# EasyEDA Pro project ProPrj_智能视觉集成板-V3.0.epro, schematic Schematic4

## Sheets
1 电源: Board Name: RGB灯板; Create Date: 2025-04-21; Page Name: 电源; Project Name: 009-智能视觉集成板-V2.0; Schematic Name: Schematic4; Update Date: 2025-04-23; Company: 嘉立创EDA; Page Size: A4; Version: V1.0
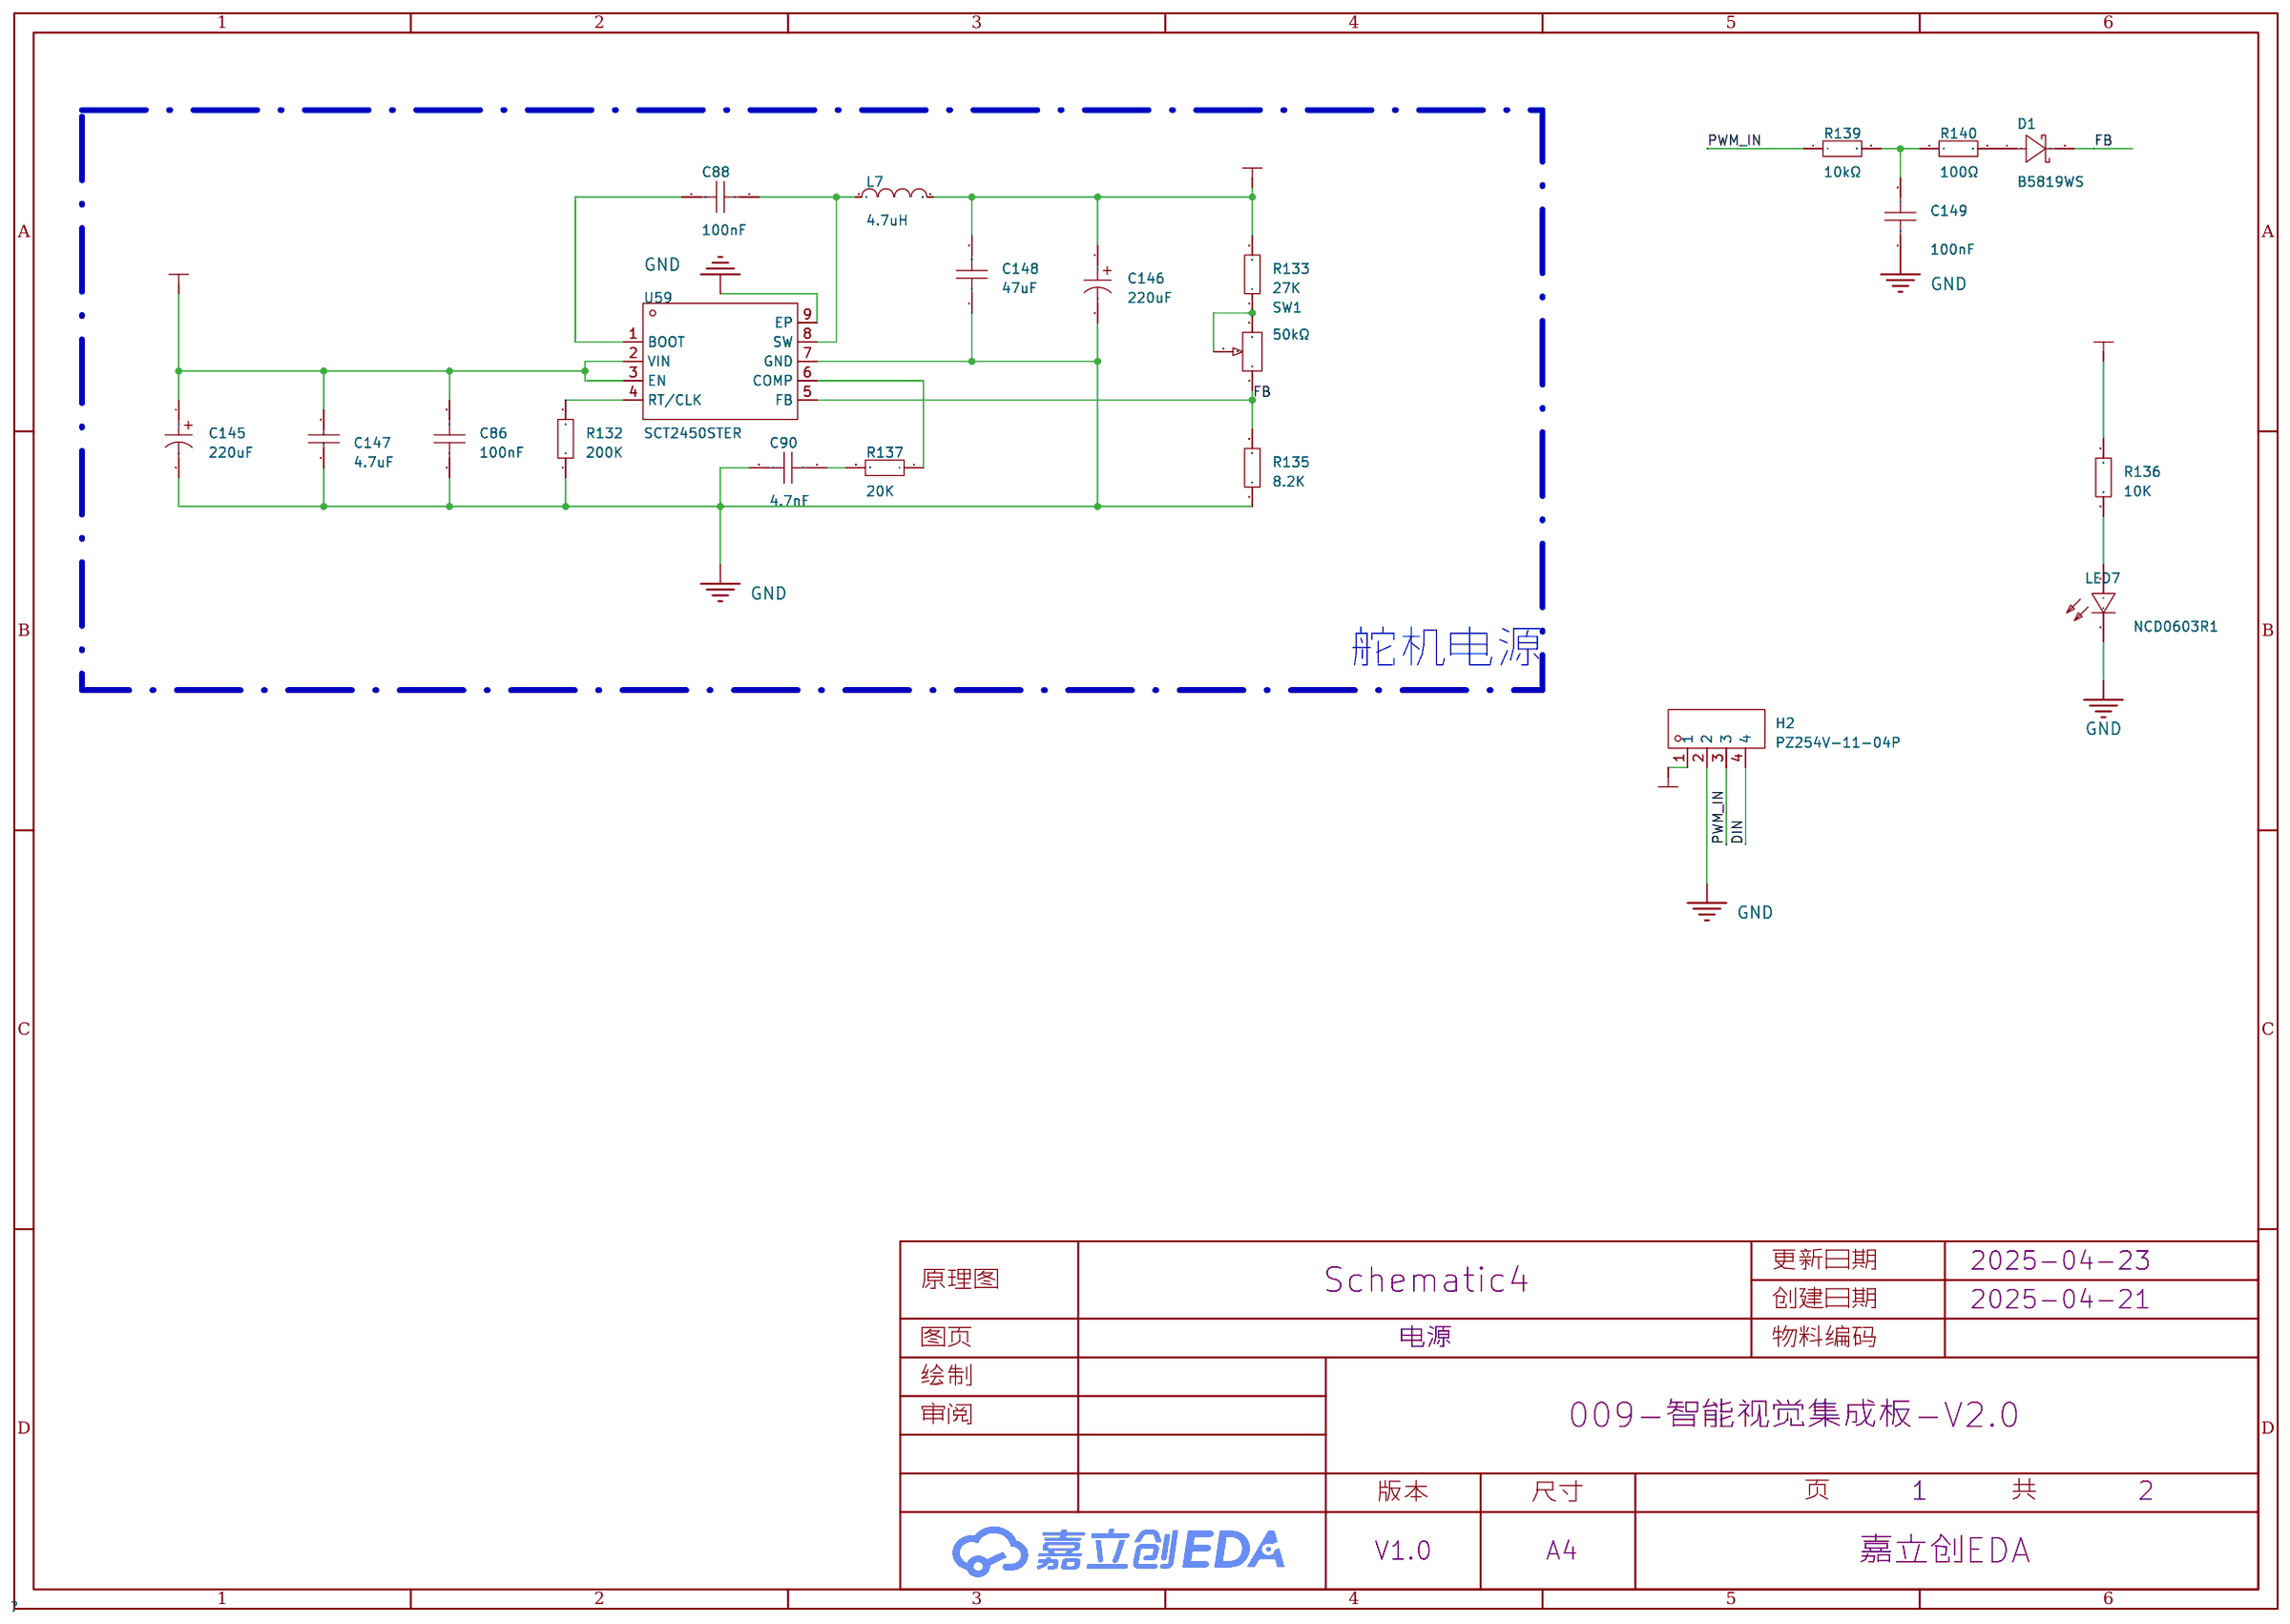
[diagram p11: 电源]
2 灯珠: Create Date: 2025-04-23; Page Name: 灯珠
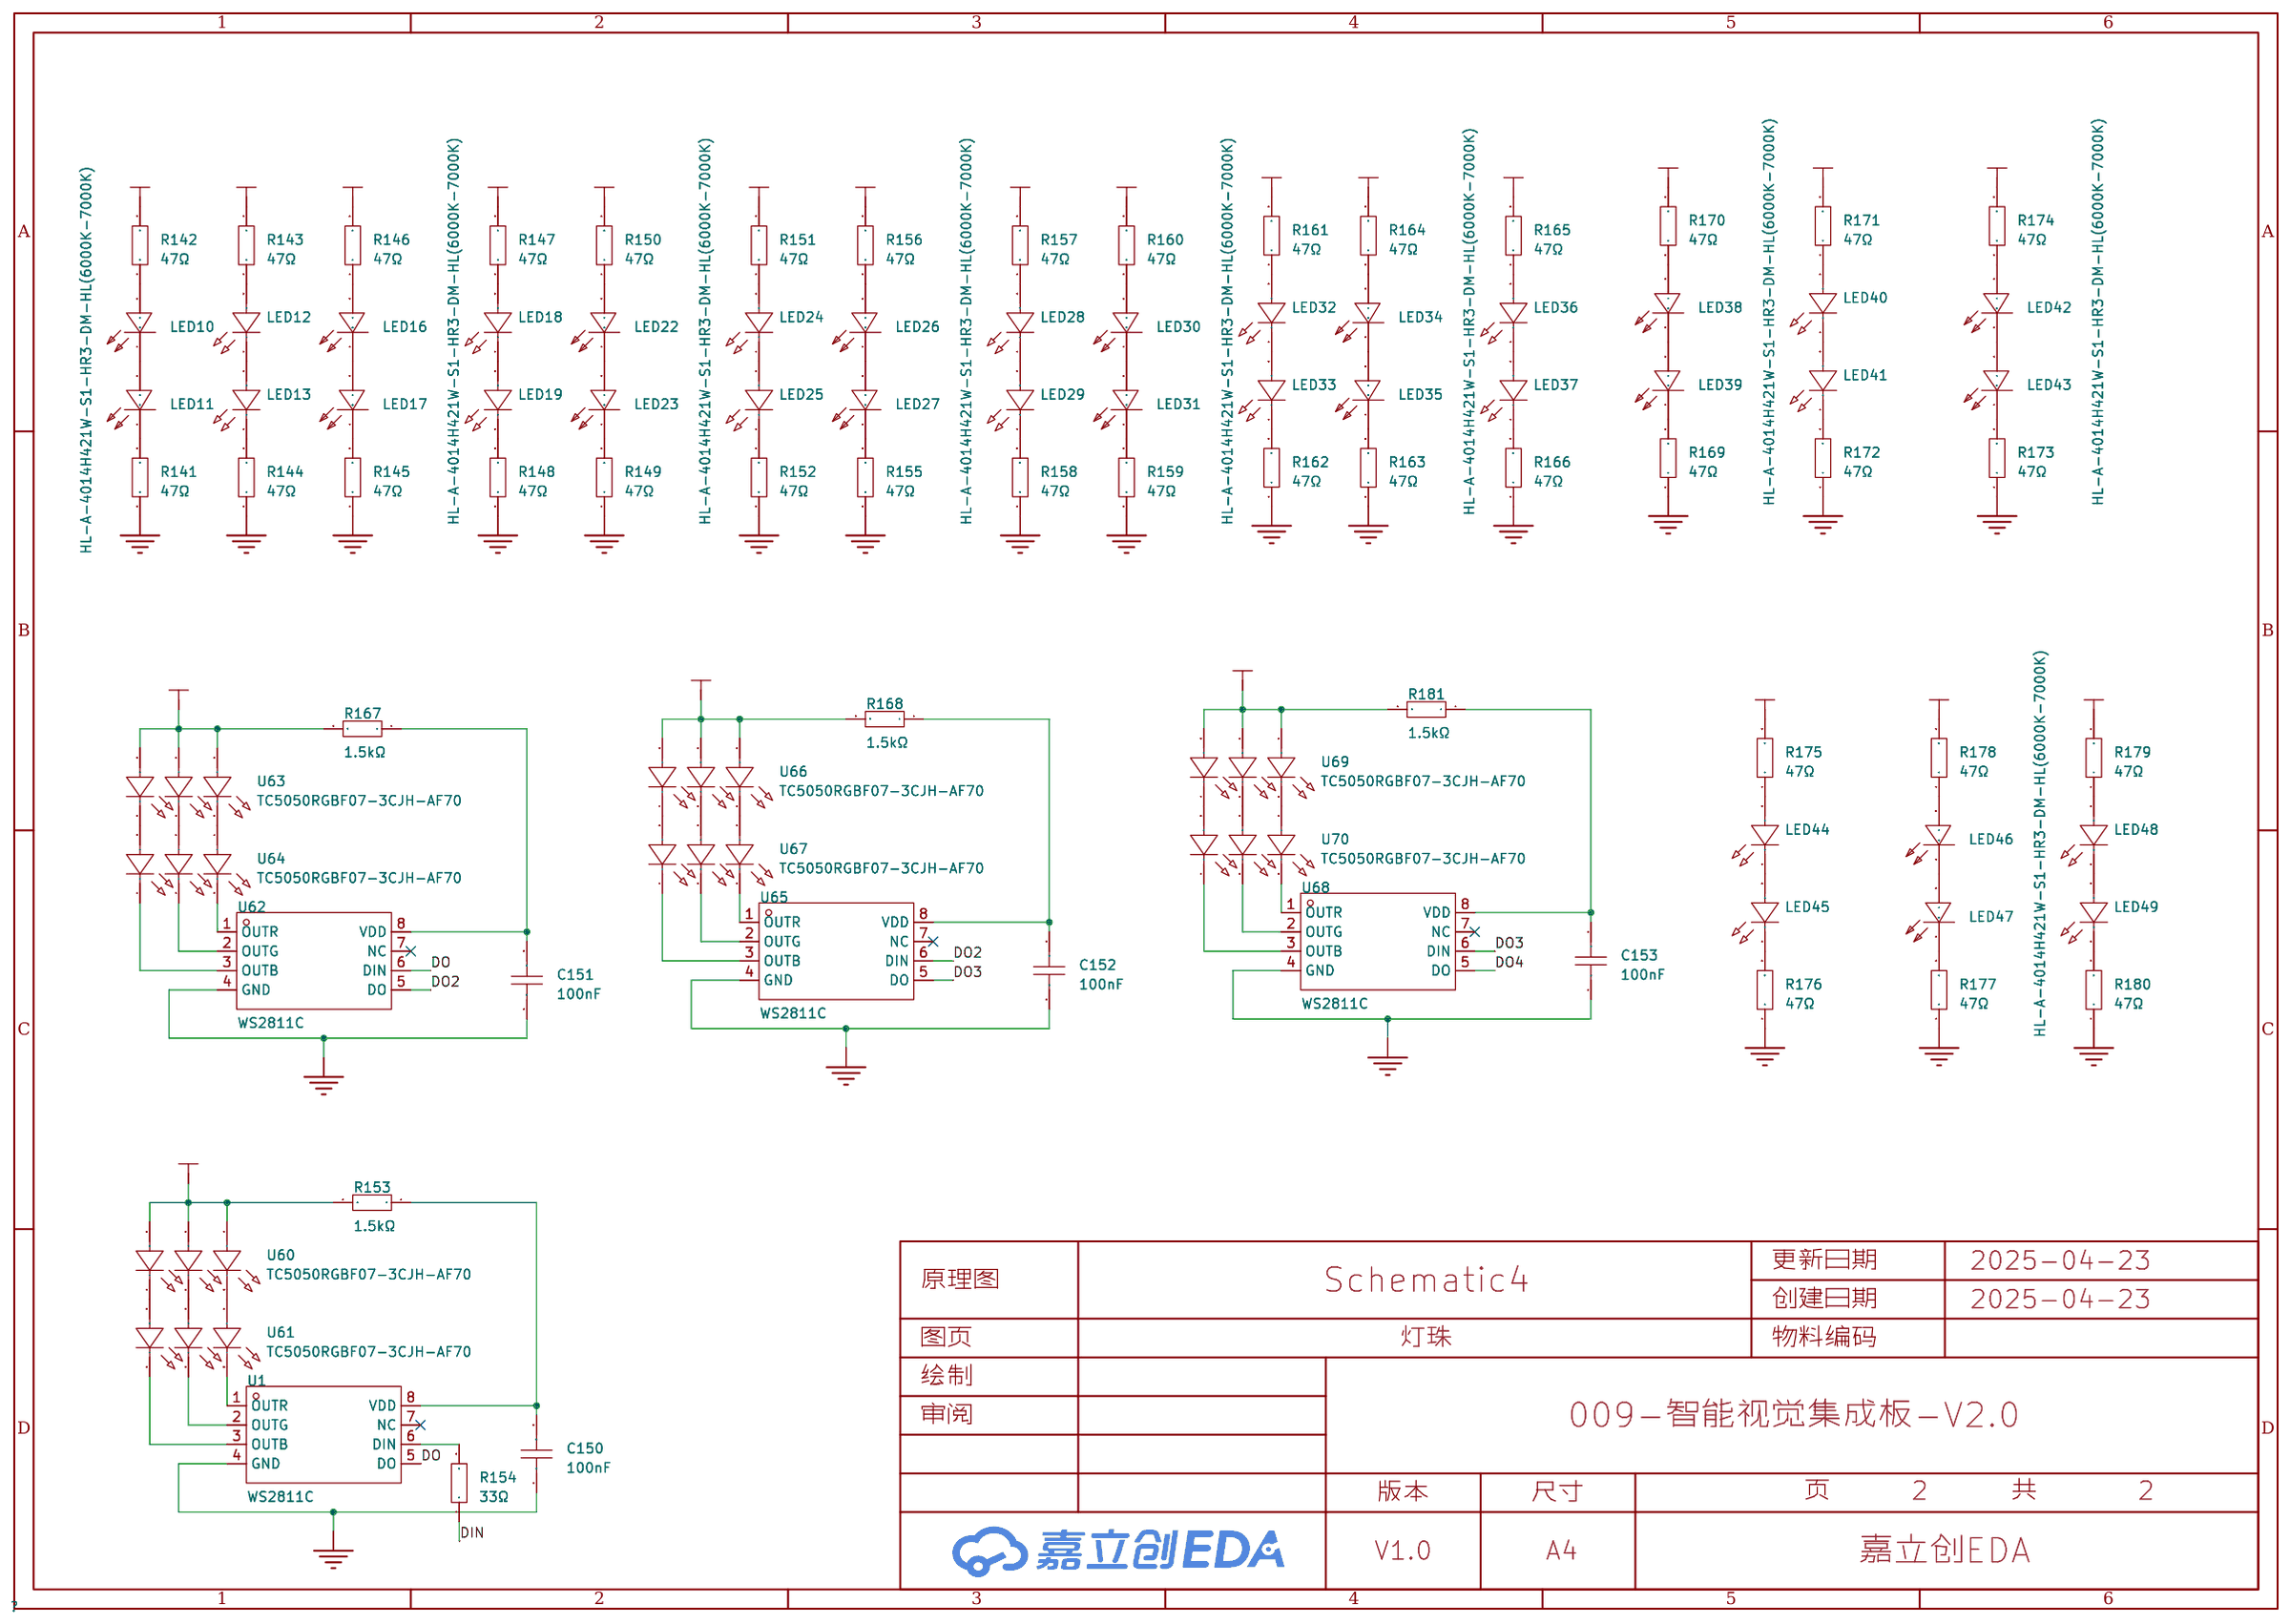
[diagram p12: 灯珠]

## Parts
sheet 灯珠
C150  100nF  [C0603]
C151  100nF  [C0603]
C152  100nF  [C0603]
C153  100nF  [C0603]
LED10  HL-A-4014H421W-S1-HR3-DM-HL(6000K-7000K)  [LED-SMD_L4.0-W1.5-RD]
LED11  HL-A-4014H421W-S1-HR3-DM-HL(6000K-7000K)  [LED-SMD_L4.0-W1.5-RD]
LED12  HL-A-4014H489W-S1-HR3-DM-HL(2800K-3100K)  [LED-SMD_L4.0-W1.5-RD]
LED13  HL-A-4014H489W-S1-HR3-DM-HL(2800K-3100K)  [LED-SMD_L4.0-W1.5-RD]
LED16  HL-A-4014H421W-S1-HR3-DM-HL(6000K-7000K)  [LED-SMD_L4.0-W1.5-RD]
LED17  HL-A-4014H421W-S1-HR3-DM-HL(6000K-7000K)  [LED-SMD_L4.0-W1.5-RD]
LED18  HL-A-4014H489W-S1-HR3-DM-HL(2800K-3100K)  [LED-SMD_L4.0-W1.5-RD]
LED19  HL-A-4014H489W-S1-HR3-DM-HL(2800K-3100K)  [LED-SMD_L4.0-W1.5-RD]
LED22  HL-A-4014H421W-S1-HR3-DM-HL(6000K-7000K)  [LED-SMD_L4.0-W1.5-RD]
LED23  HL-A-4014H421W-S1-HR3-DM-HL(6000K-7000K)  [LED-SMD_L4.0-W1.5-RD]
LED24  HL-A-4014H489W-S1-HR3-DM-HL(2800K-3100K)  [LED-SMD_L4.0-W1.5-RD]
LED25  HL-A-4014H489W-S1-HR3-DM-HL(2800K-3100K)  [LED-SMD_L4.0-W1.5-RD]
LED26  HL-A-4014H421W-S1-HR3-DM-HL(6000K-7000K)  [LED-SMD_L4.0-W1.5-RD]
LED27  HL-A-4014H421W-S1-HR3-DM-HL(6000K-7000K)  [LED-SMD_L4.0-W1.5-RD]
LED28  HL-A-4014H489W-S1-HR3-DM-HL(2800K-3100K)  [LED-SMD_L4.0-W1.5-RD]
LED29  HL-A-4014H489W-S1-HR3-DM-HL(2800K-3100K)  [LED-SMD_L4.0-W1.5-RD]
LED30  HL-A-4014H421W-S1-HR3-DM-HL(6000K-7000K)  [LED-SMD_L4.0-W1.5-RD]
LED31  HL-A-4014H421W-S1-HR3-DM-HL(6000K-7000K)  [LED-SMD_L4.0-W1.5-RD]
LED32  HL-A-4014H489W-S1-HR3-DM-HL(2800K-3100K)  [LED-SMD_L4.0-W1.5-RD]
LED33  HL-A-4014H489W-S1-HR3-DM-HL(2800K-3100K)  [LED-SMD_L4.0-W1.5-RD]
LED34  HL-A-4014H421W-S1-HR3-DM-HL(6000K-7000K)  [LED-SMD_L4.0-W1.5-RD]
LED35  HL-A-4014H421W-S1-HR3-DM-HL(6000K-7000K)  [LED-SMD_L4.0-W1.5-RD]
LED36  HL-A-4014H489W-S1-HR3-DM-HL(2800K-3100K)  [LED-SMD_L4.0-W1.5-RD]
LED37  HL-A-4014H489W-S1-HR3-DM-HL(2800K-3100K)  [LED-SMD_L4.0-W1.5-RD]
LED38  HL-A-4014H421W-S1-HR3-DM-HL(6000K-7000K)  [LED-SMD_L4.0-W1.5-RD]
LED39  HL-A-4014H421W-S1-HR3-DM-HL(6000K-7000K)  [LED-SMD_L4.0-W1.5-RD]
LED40  HL-A-4014H489W-S1-HR3-DM-HL(2800K-3100K)  [LED-SMD_L4.0-W1.5-RD]
LED41  HL-A-4014H489W-S1-HR3-DM-HL(2800K-3100K)  [LED-SMD_L4.0-W1.5-RD]
LED42  HL-A-4014H421W-S1-HR3-DM-HL(6000K-7000K)  [LED-SMD_L4.0-W1.5-RD]
LED43  HL-A-4014H421W-S1-HR3-DM-HL(6000K-7000K)  [LED-SMD_L4.0-W1.5-RD]
LED44  HL-A-4014H489W-S1-HR3-DM-HL(2800K-3100K)  [LED-SMD_L4.0-W1.5-RD]
LED45  HL-A-4014H489W-S1-HR3-DM-HL(2800K-3100K)  [LED-SMD_L4.0-W1.5-RD]
LED46  HL-A-4014H421W-S1-HR3-DM-HL(6000K-7000K)  [LED-SMD_L4.0-W1.5-RD]
LED47  HL-A-4014H421W-S1-HR3-DM-HL(6000K-7000K)  [LED-SMD_L4.0-W1.5-RD]
LED48  HL-A-4014H489W-S1-HR3-DM-HL(2800K-3100K)  [LED-SMD_L4.0-W1.5-RD]
LED49  HL-A-4014H489W-S1-HR3-DM-HL(2800K-3100K)  [LED-SMD_L4.0-W1.5-RD]
R141  47Ω  [R0805]
R142  47Ω  [R0805]
R143  47Ω  [R0805]
R144  47Ω  [R0805]
R145  47Ω  [R0805]
R146  47Ω  [R0805]
R147  47Ω  [R0805]
R148  47Ω  [R0805]
R149  47Ω  [R0805]
R150  47Ω  [R0805]
R151  47Ω  [R0805]
R152  47Ω  [R0805]
R153  1.5kΩ  [R0603]
R154  33Ω  [R0603]
R155  47Ω  [R0805]
R156  47Ω  [R0805]
R157  47Ω  [R0805]
R158  47Ω  [R0805]
R159  47Ω  [R0805]
R160  47Ω  [R0805]
R161  47Ω  [R0805]
R162  47Ω  [R0805]
R163  47Ω  [R0805]
R164  47Ω  [R0805]
R165  47Ω  [R0805]
R166  47Ω  [R0805]
R167  1.5kΩ  [R0603]
R168  1.5kΩ  [R0603]
R169  47Ω  [R0805]
R170  47Ω  [R0805]
R171  47Ω  [R0805]
R172  47Ω  [R0805]
R173  47Ω  [R0805]
R174  47Ω  [R0805]
R175  47Ω  [R0805]
R176  47Ω  [R0805]
R177  47Ω  [R0805]
R178  47Ω  [R0805]
R179  47Ω  [R0805]
R180  47Ω  [R0805]
R181  1.5kΩ  [R0603]
U1  WS2811C  [SOP-8_L4.9-W3.9-P1.27-LS6.0-BL]
U60  TC5050RGBF07-3CJH-AF70  [LED-SMD_6P-L5.0-W5.0-TL_TC5050RGBF08]
U61  TC5050RGBF07-3CJH-AF70  [LED-SMD_6P-L5.0-W5.0-TL_TC5050RGBF08]
U62  WS2811C  [SOP-8_L4.9-W3.9-P1.27-LS6.0-BL]
U63  TC5050RGBF07-3CJH-AF70  [LED-SMD_6P-L5.0-W5.0-TL_TC5050RGBF08]
U64  TC5050RGBF07-3CJH-AF70  [LED-SMD_6P-L5.0-W5.0-TL_TC5050RGBF08]
U65  WS2811C  [SOP-8_L4.9-W3.9-P1.27-LS6.0-BL]
U66  TC5050RGBF07-3CJH-AF70  [LED-SMD_6P-L5.0-W5.0-TL_TC5050RGBF08]
U67  TC5050RGBF07-3CJH-AF70  [LED-SMD_6P-L5.0-W5.0-TL_TC5050RGBF08]
U68  WS2811C  [SOP-8_L4.9-W3.9-P1.27-LS6.0-BL]
U69  TC5050RGBF07-3CJH-AF70  [LED-SMD_6P-L5.0-W5.0-TL_TC5050RGBF08]
U70  TC5050RGBF07-3CJH-AF70  [LED-SMD_6P-L5.0-W5.0-TL_TC5050RGBF08]
sheet 电源
C86  100nF  [C0603]
C88  100nF  [C0603]
C90  4.7nF  [C0603]
C145  220uF  [CAP-SMD_BD6.3-L6.6-W6.6-LS7.8-FD]
C146  220uF  [CAP-SMD_BD6.3-L6.6-W6.6-LS7.8-FD]
C147  4.7uF  [c1206]
C148  47uF  [c1206]
C149  100nF  [C0603]
D1  B5819WS  [SOD-323_L1.7-W1.3-LS2.5-FD]
H2  PZ254V-11-04P  [HDR-TH_4P-P2.54-V-M]
L7  4.7uH  [IND-SMD_L7.0-W6.6]
LED7  NCD0603R1  [LED0603-RD_RED]
R132  200K  [R0603]
R133  27K  [R0603]
R135  8.2K  [R0603]
R136  10K  [R0603]
R137  20K  [R0603]
R139  10kΩ  [R0603]
R140  100Ω  [R0603]
SW1  50kΩ  [RES-ADJ-TH_3P-L5.0-W4.5-P2.35-BR]
U59  SCT2450STER  [ESOP-8_L4.9-W3.9-P1.27-LS6.0-BL-EP]

## Library data of the parts
C150-C153 = CGA0603X7R104K500JT: 容值:100nF;精度:±10%;额定电压:50V;材质(温度系数):X7R;; LCSC Part Name: 100nF ±10% 50V; Supplier Part: C6119867; Manufacturer: HRE(芯声); Supplier Footprint: 0603; JLCPCB Part Class: 扩展库; Supplier: LCSC; Tolerance: ±10%; Voltage Rated: 50V; Temperature Coefficient: X7R
LED10 LED11 LED16 LED17 LED22 LED23 LED26 LED27 LED30 LED31 LED34 LED35 LED38 LED39 LED42 LED43 LED46 LED47 = HL-A-4014H421W-S1-HR3-DM-HL(6000K-7000K): 发光颜色:白色;正向电压(VF):3.2V;功率:288mW;正向电流:60mA;主波长:-;透镜颜色:雾状黄透镜;色温:6500K;发光角度:120°;载带方式:正贴;工作温度:-40℃~+85℃;; LCSC Part Name: 白灯 正贴 色温6500K; Supplier Part: C540979; Manufacturer: HONGLITRONIC(鸿利光电); Supplier Footprint: SMD4014; JLCPCB Part Class: 扩展库; Datasheet: https://atta.szlcsc.com/upload/public/pdf/source/20200518/C540979_90E6DF61BE042BE563F72A358322B1E3.pdf; Supplier: LCSC; Emitted Color: 白色; Forward Voltage (VF): 3.2V; Power Dissipation: 288mW; Forward Current: 60mA; Lens Color: 雾状黄透镜; Color Temperature: 6500K; Viewing Angle: 120°; Mounting Sytle: 正贴; Operating Temperature: -40℃~+85℃
LED12 LED13 LED18 LED19 LED24 LED25 LED28 LED29 LED32 LED33 LED36 LED37 LED40 LED41 LED44 LED45 LED48 LED49 = HL-A-4014H489W-S1-HR3-DM-HL(2800K-3100K): 发光颜色:白色;正向电压(VF):3.4V;功率:306mW;正向电流:60mA;主波长:-;透镜颜色:雾状黄透镜;色温:3000K;发光角度:120°;载带方式:正贴;工作温度:-40℃~+85℃;; LCSC Part Name: 白灯 正贴 色温3000K; Supplier Part: C540980; Manufacturer: HONGLITRONIC(鸿利光电); Supplier Footprint: SMD4014; JLCPCB Part Class: 扩展库; Datasheet: https://atta.szlcsc.com/upload/public/pdf/source/20200518/C540980_B9AC19FAE577749784BDD41A9FD7C64C.pdf; Supplier: LCSC; Emitted Color: 白色; Forward Voltage (VF): 3.4V; Power Dissipation: 306mW; Forward Current: 60mA; Lens Color: 雾状黄透镜; Color Temperature: 3000K; Viewing Angle: 120°; Mounting Sytle: 正贴; Operating Temperature: -40℃~+85℃
R141-R152 R155-R166 R169-R180 = 0805W8F470JT5E: 电阻类型:厚膜电阻;阻值:47Ω;精度:±1%;功率:125mW;最大工作电压:150V;温度系数:±200ppm/℃;; LCSC Part Name: 47Ω ±1% 125mW 厚膜电阻; Supplier Part: C17714; Manufacturer: UNI-ROYAL(厚声); Supplier Footprint: 0805; JLCPCB Part Class: 基础库; Datasheet: https://atta.szlcsc.com/upload/public/pdf/source/20200306/C422600_1E6D84923E4A46A82E41ADD87F860B5C.pdf; Supplier: LCSC; Type: 厚膜电阻; Tolerance: ±1%; Power(Watts): 125mW; Overload Voltage (Max): 150V; Temperature Coefficient: ±200ppm/℃; Operating Temperature Range: -55℃~+155℃
R153 R167 R168 R181 = 0603WAF1501T5E: 电阻类型:厚膜电阻;阻值:1.5kΩ;精度:±1%;功率:100mW;最大工作电压:75V;温度系数:±100ppm/℃;; LCSC Part Name: 1.5kΩ ±1% 100mW 厚膜电阻; Supplier Part: C22843; Manufacturer: UNI-ROYAL(厚声); Supplier Footprint: 0603; JLCPCB Part Class: 基础库; Datasheet: https://atta.szlcsc.com/upload/public/pdf/source/20200306/C422600_1E6D84923E4A46A82E41ADD87F860B5C.pdf; Supplier: LCSC; Type: 厚膜电阻; Tolerance: ±1%; Power(Watts): 100mW; Overload Voltage (Max): 75V; Temperature Coefficient: ±100ppm/℃; Operating Temperature Range: -55℃~+155℃
R154 = 0603WAF330JT5E: 电阻类型:厚膜电阻;阻值:33Ω;精度:±1%;功率:100mW;最大工作电压:75V;温度系数:±100ppm/℃;; LCSC Part Name: 33Ω ±1% 100mW 厚膜电阻; Supplier Part: C23140; Manufacturer: UNI-ROYAL(厚声); Supplier Footprint: 0603; JLCPCB Part Class: 基础库; Datasheet: https://atta.szlcsc.com/upload/public/pdf/source/20200306/C422600_1E6D84923E4A46A82E41ADD87F860B5C.pdf; Supplier: LCSC; Type: 厚膜电阻; Tolerance: ±1%; Power(Watts): 100mW; Overload Voltage (Max): 75V; Temperature Coefficient: ±100ppm/℃; Operating Temperature Range: -55℃~+155℃
U1 U62 U65 U68 = WS2811C: 输入电压:5V~24V;通道数:3;输出电压:20V;输出电流:32mA;; Supplier Part: C2920043; Manufacturer: worldsemi; Supplier Footprint: SOP-8; JLCPCB Part Class: 扩展库; Datasheet: https://atta.szlcsc.com/upload/public/pdf/source/20211117/9A65CCC6E94FC3084B6BF134B7D41FBE.pdf; Supplier: LCSC; Input Voltage: 5V~24V; Channels: 3; Output Voltage: 20V; Output Current: 32mA
U60 U61 U63 U64 U66 U67 U69 U70 = TC5050RGBF07-3CJH-AF70: 5050 LED灯珠  全彩灯珠 5050三基色 七彩灯珠; LCSC Part Name: LED贴片5050RGB灯珠高亮红绿蓝三色 0.2W; Supplier Part: C7495074; Manufacturer: TCWIN(天成); Supplier Footprint: SMD5050-6P; JLCPCB Part Class: 扩展库; Datasheet: https://atta.szlcsc.com/upload/public/pdf/source/20230928/4E7B1469C4A2562BECC3224328AE73AE.pdf; Supplier: LCSC
C86 C88 C90 C149 = CAP_0603: Supplier Footprint: 0603
C145 C146 = GVT1E227M0608CNVC: 容值:220uF;精度:±20%;额定电压:25V;纹波电流:120mA@120Hz;; LCSC Part Name: 220uF ±20% 25V; Supplier Part: C2983317; Manufacturer: HRK(鸿瑞凯电子); Supplier Footprint: SMD,D6.3xL7.7mm; JLCPCB Part Class: 扩展库; Datasheet: https://atta.szlcsc.com/upload/public/pdf/source/20220321/A04A91A46495B899B204BF58325E1842.pdf; Supplier: LCSC; Tolerance: ±20%; Rated Voltage: 25V; Ripple Current: 120mA@120Hz; φD: 6.3mm; L: 8mm; Lifetime @ Temp: 2000hrs@105℃; Operating Temperature: -55℃~+105℃
C147 = CL31B475KBHNNNE: 容值:4.7uF;精度:±10%;额定电压:50V;材质(温度系数):X7R;; LCSC Part Name: 4.7uF ±10% 50V; Supplier Part: C51205; Manufacturer: SAMSUNG(三星); Supplier Footprint: 1206; JLCPCB Part Class: 扩展库; Datasheet: https://atta.szlcsc.com/upload/public/pdf/source/20160218/1457707763339.pdf; Supplier: LCSC; Tolerance: ±10%; Voltage Rated: 50V; Temperature Coefficient: X7R
C148 = HGC1206R5476M250NSPJ: 容值:47uF;精度:±20%;额定电压:25V;材质(温度系数):X5R;; LCSC Part Name: 47uF ±20% 25V; Supplier Part: C22367835; Manufacturer: Chinocera(华瓷); Supplier Footprint: 1206; JLCPCB Part Class: 扩展库; Datasheet: https://atta.szlcsc.com/upload/public/pdf/source/20240326/E6CB0DC43BB858B74F4352229FABFDCA.pdf; Supplier: LCSC; Tolerance: ±20%; Voltage Rated: 25V; Temperature Coefficient: X5R
D1 = B5819WS_C7420331: 二极管配置:独立式;正向压降(Vf):600mV@1.0A;直流反向耐压(Vr):40V;整流电流:1A;; LCSC Part Name: 电压:40V 电流:1A; Supplier Part: C7420331; Manufacturer: 宏迦橙; Supplier Footprint: SOD-323; JLCPCB Part Class: 扩展库; Datasheet: https://atta.szlcsc.com/upload/public/pdf/source/20230828/03CA0F4F90DAE368A7153B7B5E4D0651.pdf; Supplier: LCSC; Diode Configuration: 独立式; Forward Voltage (Vf@If): 600mV@1.0A; Reverse Voltage (Vr): 40V; Rectified Current: 1A; Reverse Leakage Current (Ir): 1mA@40V
H2 = PZ254V-11-04P: 插针结构:1x4P;间距:2.54mm;行距:-;圆针/方针:方针;安装类型:直插;排数:单排;总PIN位数:4P;额定电流:3A;额定电压:250V;配合针长度:6mm;塑高:2.5mm;端接针长度:3mm;触头材质:-;工作温度范围:-40℃~+105℃;颜色:黑色;; LCSC Part Name: 间距:2.54mm 1x4P 直插 方针; Supplier Part: C2691448; Manufacturer: XFCN(兴飞); Supplier Footprint: 插件,P=2.54mm; JLCPCB Part Class: 扩展库; Datasheet: https://atta.szlcsc.com/upload/public/pdf/source/20200309/C492403_F9F19131791D08044AD4F84F8E751A34.pdf; Supplier: LCSC; Pin Structure: 1x4P; Pitch: 2.54mm; Circluar Pins/Square Pins: 方针; Mounting Type: 直插; Number of Rows: 单排; Number of Pins: 4P; Current Rating (Max): 3A; Voltage Rating (Max): 250V; Length of Mating Pin: 6mm; Insulation Height: 2.5mm; Length of End Connection Pin: 3mm; Operating Temperature Range: -40℃~+105℃; Color: 黑色
L7 = FXL0630-4R7-M: 电感值:4.7uH;精度:±20%;额定电流:6A;饱和电流(Isat):9A;类型:一体成型电感;; LCSC Part Name: 4.7uH ±20% 9A; Supplier Part: C167220; Manufacturer: cjiang(长江微电); Supplier Footprint: SMD,6.6x7mm; JLCPCB Part Class: 扩展库; Datasheet: https://atta.szlcsc.com/upload/public/pdf/source/20240426/3189EA8206330E2108542F9E34E540E7.pdf; Supplier: LCSC; Tolerance: ±20%; Rated Current: 6A; Saturation Current (Isat): 9A; DC Resistance (DCR): 33mΩ; Type: 一体成型电感
LED7 = NCD0603R1_C84263: 灯头类型:-;发光颜色:红色;正向电压(VF):1.6V~2.6V;功率:65mW;正向电流:20mA;主波长:615nm~630nm;二极管配置:独立二极管;透镜颜色:无色透明透镜;色温:-;发光强度:80mcd~220mcd;发光角度:130°;载带方式:-;工作温度:-30℃~+85℃;; Supplier Part: C84263; Manufacturer: 国星光电; Supplier Footprint: 0603; JLCPCB Part Class: 扩展库; Datasheet: https://atta.szlcsc.com/upload/public/pdf/source/20200820/C84263_DABC6A75E58F576973B407FDBA283D60.pdf; Supplier: LCSC; Emitted Color: 红色; Forward Voltage (VF): 1.6V~2.6V; Power Dissipation: 65mW; Forward Current: 20mA; Dominant Wavelength: 615nm~630nm; Diode Configuration: 独立二极管; Lens Color: 无色透明透镜; Luminous Intensity: 80mcd~220mcd; Viewing Angle: 130°; Operating Temperature: -30℃~+85℃
R132 R133 R135-R137 = Res_0603: Supplier Footprint: 0603
R139 = 0603WAF1002T5E: 电阻类型:厚膜电阻;阻值:10kΩ;精度:±1%;功率:100mW;最大工作电压:75V;温度系数:±100ppm/℃;; LCSC Part Name: 厚膜电阻 10kΩ ±1% 100mW; Supplier Part: C25804; Manufacturer: UNI-ROYAL(厚声); Supplier Footprint: 0603; JLCPCB Part Class: 基础库; Datasheet: https://atta.szlcsc.com/upload/public/pdf/source/20200306/C422600_1E6D84923E4A46A82E41ADD87F860B5C.pdf; Supplier: LCSC; Type: 厚膜电阻; Tolerance: ±1%; Power(Watts): 100mW; Overload Voltage (Max): 75V; Temperature Coefficient: ±100ppm/℃; Operating Temperature Range: -55℃~+155℃
R140 = 0603WAF1000T5E: 电阻类型:厚膜电阻;阻值:100Ω;精度:±1%;功率:100mW;最大工作电压:75V;温度系数:±200ppm/℃;; LCSC Part Name: 100Ω ±1% 100mW 厚膜电阻; Supplier Part: C22775; Manufacturer: UNI-ROYAL(厚声); Supplier Footprint: 0603; JLCPCB Part Class: 基础库; Datasheet: https://atta.szlcsc.com/upload/public/pdf/source/20200306/C422600_1E6D84923E4A46A82E41ADD87F860B5C.pdf; Supplier: LCSC; Type: 厚膜电阻; Tolerance: ±1%; Power(Watts): 100mW; Overload Voltage (Max): 75V; Temperature Coefficient: ±200ppm/℃; Operating Temperature Range: -55℃~+155℃
SW1 = ST-4ETA503: 阻值:50kΩ;精度:±20%;功率:250mW;温度系数:±100ppm/℃;; LCSC Part Name: 50kΩ ±20%; Supplier Part: C2922091; Manufacturer: NIDEC(尼得科); Supplier Footprint: SMD-3P,5x4.5mm; JLCPCB Part Class: 扩展库; Datasheet: https://atta.szlcsc.com/upload/public/pdf/source/20220330/1528DAC6A30CFC893208E701DB45B901.pdf; Supplier: LCSC; Tolerance: ±20%; Power(Watts): 250mW; Temperature Coefficient: ±100ppm/℃; Turns: 1
U59 = SCT2450STER: 功能类型:降压型;输入电压:3.8V~36V;输出电流:5A;; LCSC Part Name: 3.8V-36V输入,5A输出,高效率同步降压DC-DC转换器; Supplier Part: C509400; Manufacturer: SCT(芯洲科技); Supplier Footprint: ESOP-8; JLCPCB Part Class: 扩展库; Datasheet: https://atta.szlcsc.com/upload/public/pdf/source/20200407/C509400_EDF779A672A59398CFBA9E95FA584FEC.pdf; Supplier: LCSC; Function: 降压型; Input Voltage: 3.8V~36V; Output Current: 5A; Switching Frequency: 100kHz~1.1MHz; Operating Temperature: -40℃~+125℃@(TJ); Synchronous Rectification: 是; Number of Outputs: 1; Switch tube (built-in/external): 内置

## Nets
GND: C86.1 C90.2 C145.2 C146.2 C147.1 C148.1 C149.1 C150.1 C151.1 C152.1 C153.1 H2.2 LED7.1(K) R132.1 R135.1 R141.1 R144.1 R145.1 R148.1 R149.1 R152.1 R155.1 R158.1 R159.1 R162.1 R163.1 R166.1 R169.1 R172.1 R173.1 R176.1 R177.1 R180.1 U1.4(GND) U59.7(GND) U59.9(EP) U62.4(GND) U65.4(GND) U68.4(GND)
VCC_BAT: C86.2 C145.1 C147.2 H2.1 U59.2(VIN) U59.3(EN)
VCC_OUT: C146.1 C148.2 L7.2 R133.2 R136.2 R142.2 R143.2 R146.2 R147.2 R150.2 R151.2 R153.2 R156.2 R157.2 R160.2 R161.2 R164.2 R165.2 R167.2 R168.2 R170.2 R171.2 R174.2 R175.2 R178.2 R179.2 R181.2 U60.1(+) U60.2(+) U60.3(+) U63.1(+) U63.2(+) U63.3(+) U66.1(+) U66.2(+) U66.3(+) U69.1(+) U69.2(+) U69.3(+)
DIN: H2.4 R154.1
DO: U1.5(DO) U62.6(DIN)
DO2: U62.5(DO) U65.6(DIN)
DO3: U65.5(DO) U68.6(DIN)
DO4: U68.5(DO)
FB: D1.2(K) R135.2 SW1.1 U59.5(FB)
PWM_IN: H2.3 R139.1
$1N753: C90.1 R137.2
$1N754: R137.1 U59.6(COMP)
$1N755: C88.1 U59.1(BOOT)
$1N758: C88.2 L7.1 U59.8(SW)
$1N761: R133.1 SW1.2 SW1.3
$1N762: R132.2 U59.4(RT/CLK)
$1N1131: C149.2 R139.2 R140.1
$1N1184: D1.1(A) R140.2
$2N337: LED10.1(C) LED11.2(A)
$2N339: LED11.1(C) R141.2
$2N539: LED12.1(K) LED13.2(A)
$2N617: LED13.1(K) R144.2
$2N1087: LED16.1(C) LED17.2(A)
$2N1089: LED17.1(C) R145.2
$2N1099: LED18.1(K) LED19.2(A)
$2N1103: LED19.1(K) R148.2
$2N1551: LED22.1(C) LED23.2(A)
$2N1553: LED23.1(C) R149.2
$2N1563: LED24.1(K) LED25.2(A)
$2N1567: LED25.1(K) R152.2
$2N1661: LED10.2(A) R142.1
$2N1663: LED12.2(A) R143.1
$2N1665: LED16.2(A) R146.1
$2N1667: LED18.2(A) R147.1
$2N1669: LED22.2(A) R150.1
$2N1671: LED24.2(A) R151.1
$2N1715: U60.5(-) U61.2(+)
$2N1717: U60.6(-) U61.1(+)
$2N1719: U60.4(-) U61.3(+)
$2N1762: U1.3(OUTB) U61.4(-)
$2N1767: U1.2(OUTG) U61.5(-)
$2N1773: U1.1(OUTR) U61.6(-)
$2N1779: C150.2 R153.1 U1.8(VDD)
$2N1863: R154.2 U1.6(DIN)
$2N3390: LED26.1(C) LED27.2(A)
$2N3392: LED27.1(C) R155.2
$2N3398: LED28.1(K) LED29.2(A)
$2N3400: LED29.1(K) R158.2
$2N3406: LED30.1(C) LED31.2(A)
$2N3408: LED31.1(C) R159.2
$2N3414: LED32.1(K) LED33.2(A)
$2N3416: LED33.1(K) R162.2
$2N3422: LED34.1(C) LED35.2(A)
$2N3424: LED35.1(C) R163.2
$2N3430: LED36.1(K) LED37.2(A)
$2N3432: LED37.1(K) R166.2
$2N3438: LED26.2(A) R156.1
$2N3440: LED28.2(A) R157.1
$2N3442: LED30.2(A) R160.1
$2N3444: LED32.2(A) R161.1
$2N3446: LED34.2(A) R164.1
$2N3448: LED36.2(A) R165.1
$2N3778: U63.5(-) U64.2(+)
$2N3780: U63.6(-) U64.1(+)
$2N3782: U63.4(-) U64.3(+)
$2N3792: U62.3(OUTB) U64.4(-)
$2N3795: U62.2(OUTG) U64.5(-)
$2N3798: U62.1(OUTR) U64.6(-)
$2N3800: C151.2 R167.1 U62.8(VDD)
$2N4063: U66.5(-) U67.2(+)
$2N4065: U66.6(-) U67.1(+)
$2N4067: U66.4(-) U67.3(+)
$2N4077: U65.3(OUTB) U67.4(-)
$2N4080: U65.2(OUTG) U67.5(-)
$2N4083: U65.1(OUTR) U67.6(-)
$2N4085: C152.2 R168.1 U65.8(VDD)
$2N5173: LED38.1(C) LED39.2(A)
$2N5175: LED39.1(C) R169.2
$2N5181: LED40.1(K) LED41.2(A)
$2N5183: LED41.1(K) R172.2
$2N5189: LED42.1(C) LED43.2(A)
$2N5191: LED43.1(C) R173.2
$2N5197: LED44.1(K) LED45.2(A)
$2N5199: LED45.1(K) R176.2
$2N5205: LED46.1(C) LED47.2(A)
$2N5207: LED47.1(C) R177.2
$2N5213: LED48.1(K) LED49.2(A)
$2N5215: LED49.1(K) R180.2
$2N5221: LED38.2(A) R170.1
$2N5223: LED40.2(A) R171.1
$2N5225: LED42.2(A) R174.1
$2N5227: LED44.2(A) R175.1
$2N5229: LED46.2(A) R178.1
$2N5231: LED48.2(A) R179.1
$2N5477: U69.5(-) U70.2(+)
$2N5479: U69.6(-) U70.1(+)
$2N5481: U69.4(-) U70.3(+)
$2N5491: U68.3(OUTB) U70.4(-)
$2N5494: U68.2(OUTG) U70.5(-)
$2N5497: U68.1(OUTR) U70.6(-)
$2N5499: C153.2 R181.1 U68.8(VDD)
Net-(LED7-2): LED7.2(A) R136.1

Not connected (* = marked no-connect by the designer): U1 7(NC)*; U62 7(NC)*; U65 7(NC)*; U68 7(NC)*

## Notes on the sheets
sheet 1
- 舵机电源
